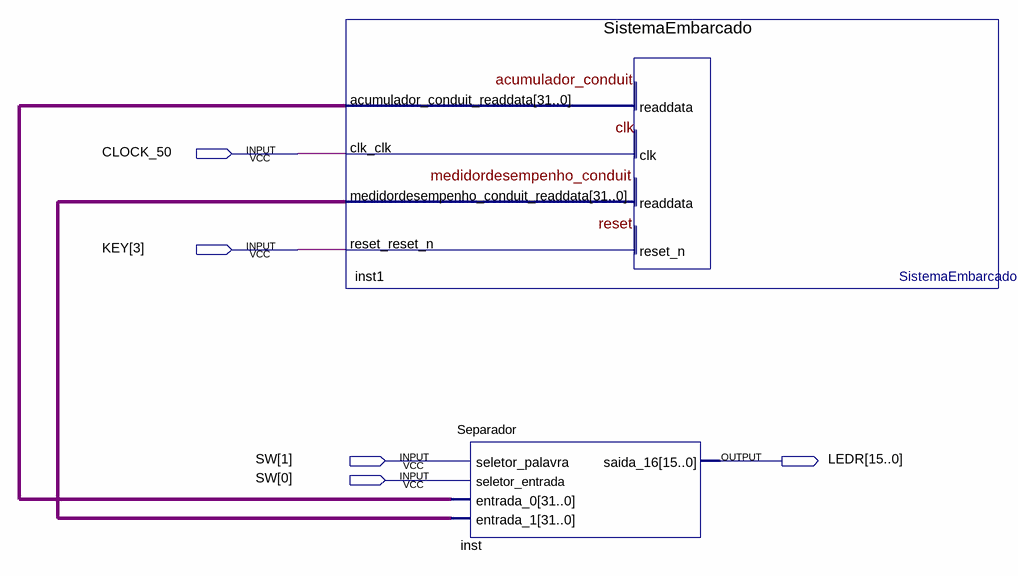
[diagram p0: schematic sheet]
// Quartus schematic AcumuladorNios.bdf as structural Verilog: 2 symbols, 5 pins
module AcumuladorNios (
  input  CLOCK_50,
  input  [3:3] KEY,
  input  [1:0] SW,
  output [15:0] LEDR
);

  wire [31:0] inst1_acumulador_conduit_readdata, inst1_medidordesempenho_conduit_readdata;

  SistemaEmbarcado inst1 (
    .clk_clk(CLOCK_50), .reset_reset_n(KEY[3]),
    .acumulador_conduit_readdata(inst1_acumulador_conduit_readdata),
    .medidordesempenho_conduit_readdata(inst1_medidordesempenho_conduit_readdata));
  Separador inst (
    .seletor_palavra(SW[1]), .seletor_entrada(SW[0]), .entrada_0(inst1_acumulador_conduit_readdata),
    .entrada_1(inst1_medidordesempenho_conduit_readdata), .saida_16(LEDR));
endmodule
